# EAGLE schematic sensor_board_v0.1 (EAGLE 8.0.1)
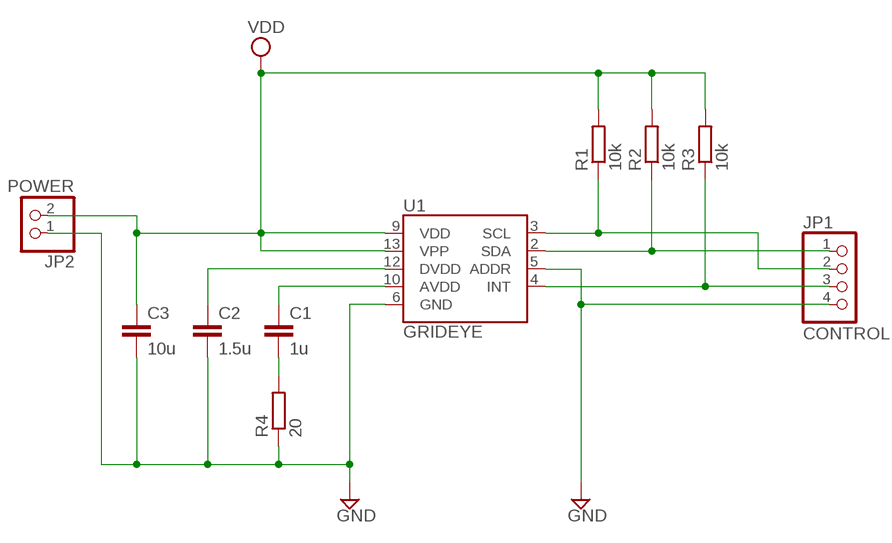
[diagram p0: schematic, sheet 1]

## Parts
C1  1u  C-EUC0805  [C0805]
C2  1.5u  C-EUC0805  [C0805]
C3  10u  C-EUC0805  [C0805]
JP1  CONTROL  PINHD-1X4  [1X04]
JP2  POWER  PINHD-1X2  [1X02]
R1  10k  R-EU_R0805  [R0805]
R2  10k  R-EU_R0805  [R0805]
R3  10k  R-EU_R0805  [R0805]
R4  20  R-EU_R0805  [R0805]
U1  GRIDEYE  [GRIDEYE-AMG88]

## Nets
AVDD: C1.1 U1.10(AVDD)
DVDD: C2.1 U1.12(DVDD)
GND: C2.2 C3.2 JP1.4 JP2.1 R4.1 U1.5(ADDR) U1.6(GND)
INT: JP1.3 R3.1 U1.4(INT)
N$6: C1.2 R4.2
SCL: JP1.2 R1.1 U1.3(SCL)
SDA: JP1.1 R2.1 U1.2(SDA)
VDD: C3.1 JP2.2 R1.2 R2.2 R3.2 U1.9(VDD) U1.13(VPP)

## Library data of the parts
C1-C3 = resistor:C-EU: CAPACITOR, European symbol
JP1 = pinhead:PINHD-1X4: PIN HEADER
JP2 = pinhead:PINHD-1X2: PIN HEADER
R1-R4 = resistor:R-EU_: RESISTOR, European symbol
U1 = Grideye:GRIDEYE